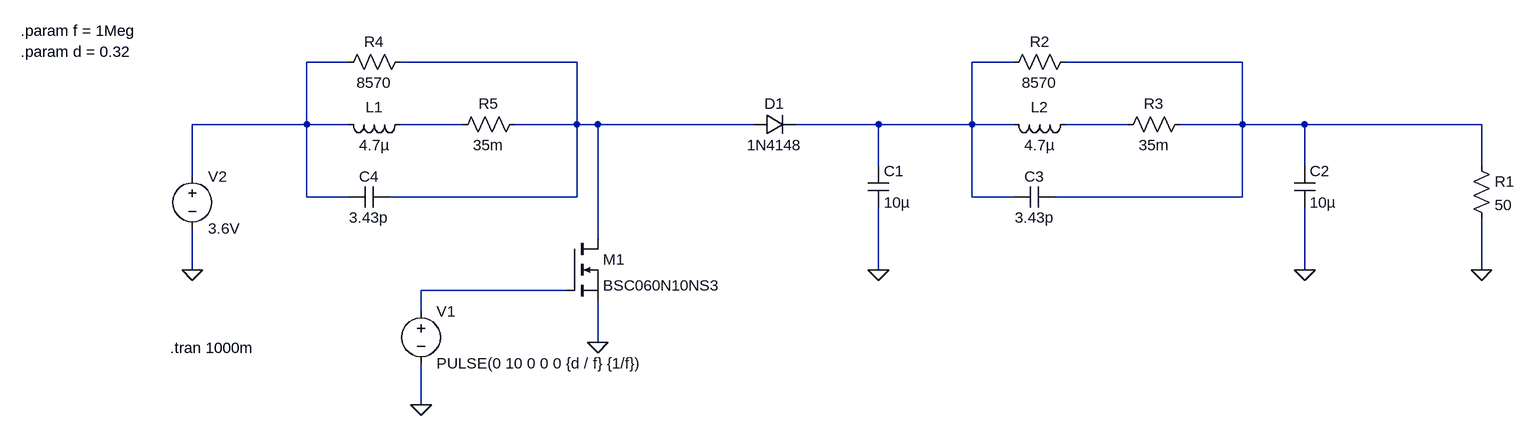
[diagram p0: schematic 700_psu.asc]
700_psu.asc, the LTspice schematic file:
Version 4
SHEET 1 1528 680
WIRE -272 16 -336 16
WIRE 80 16 -192 16
WIRE 752 16 688 16
WIRE 1104 16 832 16
WIRE -336 112 -336 16
WIRE -336 112 -512 112
WIRE -272 112 -336 112
WIRE -96 112 -192 112
WIRE 80 112 80 16
WIRE 80 112 -16 112
WIRE 112 112 80 112
WIRE 352 112 112 112
WIRE 544 112 416 112
WIRE 688 112 688 16
WIRE 688 112 544 112
WIRE 752 112 688 112
WIRE 928 112 832 112
WIRE 1104 112 1104 16
WIRE 1104 112 1008 112
WIRE 1200 112 1104 112
WIRE 1472 112 1200 112
WIRE 544 176 544 112
WIRE 1200 176 1200 112
WIRE 1472 176 1472 112
WIRE -512 192 -512 112
WIRE -336 224 -336 112
WIRE -272 224 -336 224
WIRE 80 224 80 112
WIRE 80 224 -208 224
WIRE 688 224 688 112
WIRE 752 224 688 224
WIRE 1104 224 1104 112
WIRE 1104 224 816 224
WIRE 112 288 112 112
WIRE -512 336 -512 272
WIRE 544 336 544 240
WIRE 1200 336 1200 240
WIRE 1472 336 1472 256
WIRE 64 368 -160 368
WIRE -160 400 -160 368
WIRE 112 448 112 384
WIRE -160 544 -160 480
FLAG -512 336 0
FLAG 112 448 0
FLAG 544 336 0
FLAG -160 544 0
FLAG 1472 336 0
FLAG 1200 336 0
SYMBOL cap 528 176 R0
SYMATTR InstName C1
SYMATTR Value 10µ
SYMBOL diode 352 128 R270
WINDOW 0 32 32 VTop 2
WINDOW 3 0 32 VBottom 2
SYMATTR InstName D1
SYMATTR Value 1N4148
SYMBOL voltage -512 176 R0
WINDOW 123 0 0 Left 0
WINDOW 39 0 0 Left 0
SYMATTR InstName V2
SYMATTR Value 3.6V
SYMBOL nmos 64 288 R0
SYMATTR InstName M1
SYMATTR Value BSC060N10NS3
SYMBOL voltage -160 384 R0
WINDOW 123 0 0 Left 0
WINDOW 39 0 0 Left 0
SYMATTR InstName V1
SYMATTR Value PULSE(0 10 0 0 0 {d / f} {1/f})
SYMBOL res 1456 160 R0
SYMATTR InstName R1
SYMATTR Value 50
SYMBOL ind 848 96 R90
WINDOW 0 5 56 VBottom 2
WINDOW 3 32 56 VTop 2
SYMATTR InstName L2
SYMATTR Value 4.7µ
SYMBOL cap 1184 176 R0
SYMATTR InstName C2
SYMATTR Value 10µ
SYMBOL cap 816 208 R90
WINDOW 0 0 32 VBottom 2
WINDOW 3 32 32 VTop 2
SYMATTR InstName C3
SYMATTR Value 3.43p
SYMBOL res 848 0 R90
WINDOW 0 0 56 VBottom 2
WINDOW 3 32 56 VTop 2
SYMATTR InstName R2
SYMATTR Value 8570
SYMBOL res 1024 96 R90
WINDOW 0 0 56 VBottom 2
WINDOW 3 32 56 VTop 2
SYMATTR InstName R3
SYMATTR Value 35m
SYMBOL ind -176 96 R90
WINDOW 0 5 56 VBottom 2
WINDOW 3 32 56 VTop 2
SYMATTR InstName L1
SYMATTR Value 4.7µ
SYMBOL cap -208 208 R90
WINDOW 0 0 32 VBottom 2
WINDOW 3 32 32 VTop 2
SYMATTR InstName C4
SYMATTR Value 3.43p
SYMBOL res -176 0 R90
WINDOW 0 0 56 VBottom 2
WINDOW 3 32 56 VTop 2
SYMATTR InstName R4
SYMATTR Value 8570
SYMBOL res 0 96 R90
WINDOW 0 0 56 VBottom 2
WINDOW 3 32 56 VTop 2
SYMATTR InstName R5
SYMATTR Value 35m
TEXT -776 -32 Left 2 !.param f = 1Meg
TEXT -776 0 Left 2 !.param d = 0.32
TEXT -546 456 Left 2 !.tran 1000m

The netlist it stands for:
* 700_psu.asc
C1 N003 0 10µ
D1 N002 N003 1N4148
V2 N001 0 3.6V
M1 N002 N007 0 0 BSC060N10NS3
V1 N007 0 PULSE(0 10 0 0 0 {d / f} {1/f})
R1 N004 0 50
L2 N006 N003 4.7µ
C2 N004 0 10µ
C3 N004 N003 3.43p
R2 N004 N003 8570
R3 N004 N006 35m
L1 N005 N001 4.7µ
C4 N002 N001 3.43p
R4 N002 N001 8570
R5 N002 N005 35m
.model D D
.lib standard.dio
.model NMOS NMOS
.model PMOS PMOS
.lib standard.mos
.param f = 1Meg
.param d = 0.32
.tran 1000m
.backanno
.end